# Altium schematic sheet PICZone.SchDoc: PIC
size A4; Organization: Autobot Limited; Address1: 96, boulevard Bessiere; Address4: 75017 PARIS; SheetNumber: 3
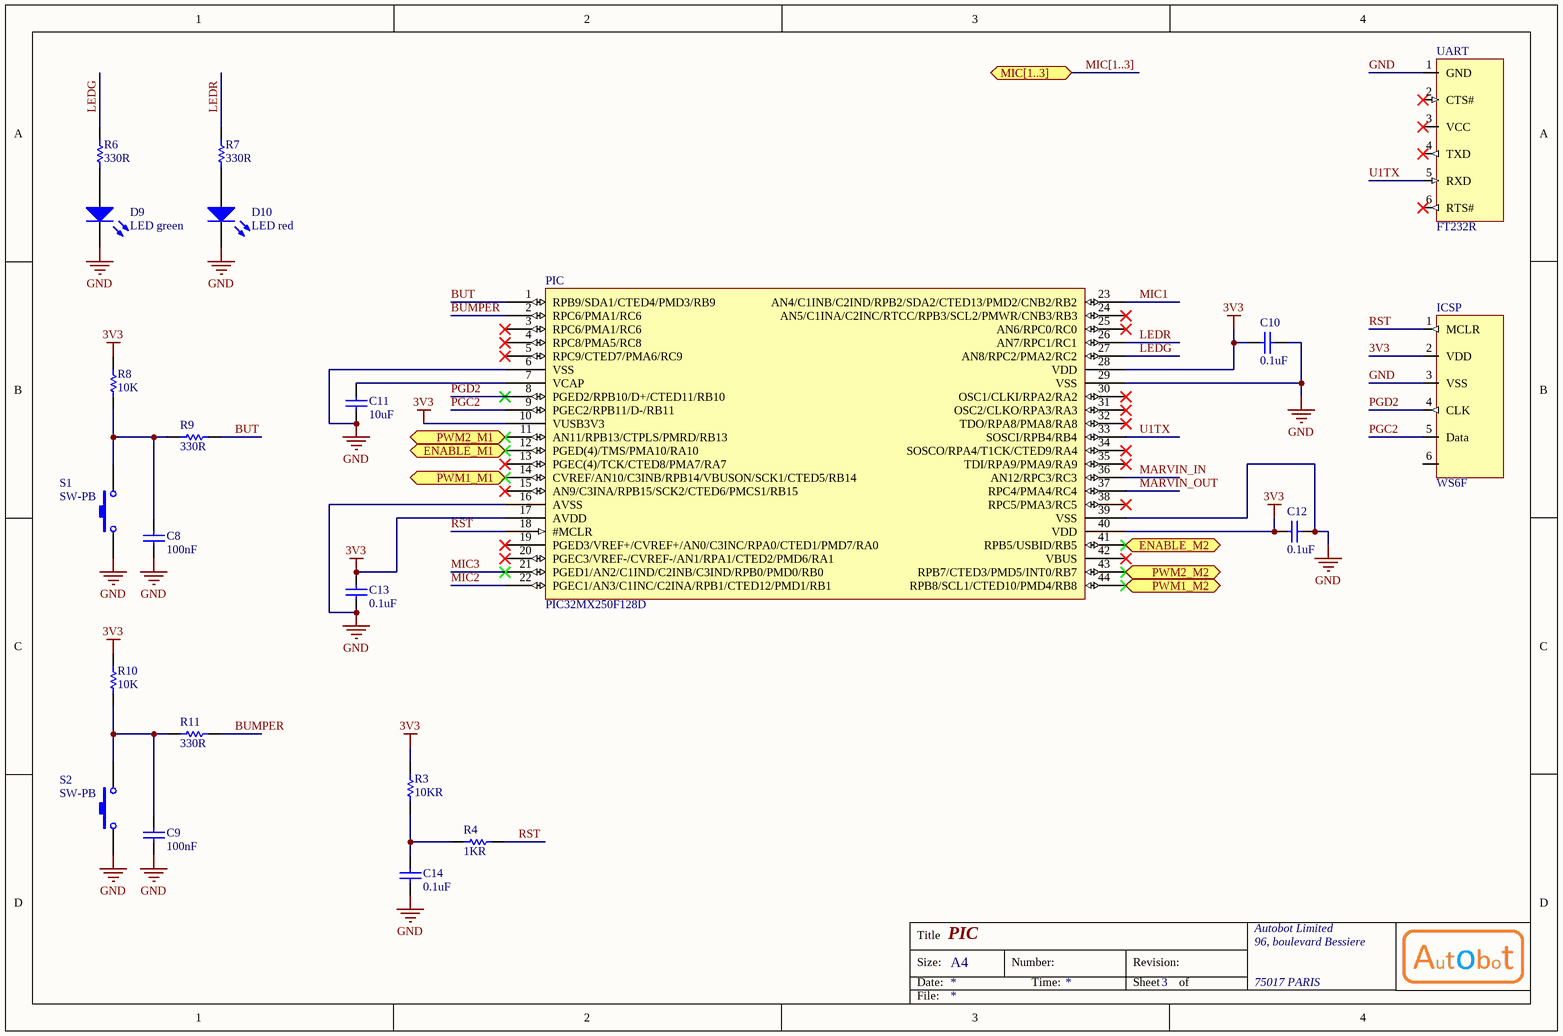
[diagram p0: PICZone.SchDoc]

## Parts
C8  100nF  [CAPC1608N]
C9  100nF  [CAPC1608N]
C10  0.1uF  [CAPC1608N]
C11  10uF  [CAPC1608N]
C12  0.1uF  [CAPC1608N]
C13  0.1uF  [CAPC1608N]
C14  0.1uF  [CAPC1608N]
D9  LED green  [LED1608]
D10  LED red  [LED1608]
ICSP  WS6F  [6-pin Connector]
PIC  PIC32MX250F128D  [44TQFP]
R3  10KR  [RESC1608N]
R4  1KR  [RESC1608N]
R6  330R  [RESC1608N]
R7  330R  [RESC1608N]
R8  10K  [RESC1608N]
R9  330R  [RESC1608N]
R10  10K  [RESC1608N]
R11  330R  [RESC1608N]
S1  SW-PB  [SPST-2]
S2  SW-PB  [SPST-2]
UART  FT232R  [6-pin Connector]

## Ports
ENABLE_M1 (out), ENABLE_M2 (out), MIC[1..3], PWM1_M1 (out), PWM1_M2 (out), PWM2_M1 (out), PWM2_M2 (out)

## Nets
3V3: C10.2 C12.2 C13.1 ICSP.2(VDD) PIC.10(VUSB3V3) PIC.17(AVDD) PIC.28(VDD) PIC.40(VDD) R3.1 R8.2 R10.2
GND: C8.2 C9.2 C10.1 C11.2 C12.1 C13.2 C14.1 D9.2(K) D10.2(K) ICSP.3(VSS) PIC.6(VSS) PIC.16(AVSS) PIC.29(VSS) PIC.39(VSS) S1.1 S2.1 UART.1(GND)
BUMPER: PIC.2(RPC6/PMA1/RC6) R11.1
BUT: PIC.1(RPB9/SDA1/CTED4/PMD3/RB9) R9.1
ENABLE_M1: PIC.12(PGED(4)/TMS/PMA10/RA10) ; port ENABLE_M1
ENABLE_M2: PIC.41(RPB5/USBID/RB5) ; port ENABLE_M2
LEDG: PIC.27(AN8/RPC2/PMA2/RC2) R6.2
LEDR: PIC.26(AN7/RPC1/RC1) R7.2
MARVIN_IN: PIC.36(AN12/RPC3/RC3)
MARVIN_OUT: PIC.37(RPC4/PMA4/RC4)
MIC1: PIC.23(AN4/C1INB/C2IND/RPB2/SDA2/CTED13/PMD2/CNB2/RB2)
MIC2: PIC.22(PGEC1/AN3/C1INC/C2INA/RPB1/CTED12/PMD1/RB1)
MIC3: PIC.21(PGED1/AN2/C1IND/C2INB/C3IND/RPB0/PMD0/RB0)
PGC2: ICSP.5(Data) PIC.9(PGEC2/RPB11/D-/RB11)
PGD2: ICSP.4(CLK) PIC.8(PGED2/RPB10/D+/CTED11/RB10)
PWM1_M1: PIC.14(CVREF/AN10/C3INB/RPB14/VBUSON/SCK1/CTED5/RB14) ; port PWM1_M1
PWM1_M2: PIC.44(RPB8/SCL1/CTED10/PMD4/RB8) ; port PWM1_M2
PWM2_M1: PIC.11(AN11/RPB13/CTPLS/PMRD/RB13) ; port PWM2_M1
PWM2_M2: PIC.43(RPB7/CTED3/PMD5/INT0/RB7) ; port PWM2_M2
RST: ICSP.1(MCLR) PIC.18(#MCLR) R4.1
U1TX: PIC.33(SOSCI/RPB4/RB4) UART.5(RXD)
NetC8_1: C8.1 R8.1 R9.2 S1.2
NetC9_1: C9.1 R10.1 R11.2 S2.2
NetC11_1: C11.1 PIC.7(VCAP)
NetC14_2: C14.2 R3.2 R4.2
NetD9_1: D9.1(A) R6.1
NetD10_1: D10.1(A) R7.1

Not connected (* = marked no-connect by the designer): ICSP 6; PIC 3(RPC6/PMA1/RC6)* 4(RPC8/PMA5/RC8)* 5(RPC9/CTED7/PMA6/RC9)* 13(PGEC(4)/TCK/CTED8/PMA7/RA7)* 15(AN9/C3INA/RPB15/SCK2/CTED6/PMCS1/RB15)* 19(PGED3/VREF+/CVREF+/AN0/C3INC/RPA0/CTED1/PMD7/RA0)* 20(PGEC3/VREF-/CVREF-/AN1/RPA1/CTED2/PMD6/RA1)* 24(AN5/C1INA/C2INC/RTCC/RPB3/SCL2/PMWR/CNB3/RB3)* 25(AN6/RPC0/RC0)* 30(OSC1/CLKI/RPA2/RA2)* 31(OSC2/CLKO/RPA3/RA3)* 32(TDO/RPA8/PMA8/RA8)* 34(SOSCO/RPA4/T1CK/CTED9/RA4)* 35(TDI/RPA9/PMA9/RA9)* 38(RPC5/PMA3/RC5)* 42(VBUS)*; UART 2(CTS#)* 3(VCC)* 4(TXD)* 6(RTS#)*

## Buses and harness runs
bus MIC[1..3] = port MIC[1..3]

## Notes on the sheet
- Title
- Size:
- Date:
- A4
- Number:
- Time:
- Revision:
- Sheet
- of
- File:

## Library data of the parts
C8-C14 = Cap: Capacitor; Published: 8-Jun-2000; LatestRevisionDate: 17-Jul-2002; LatestRevisionNote: Re-released for DXP Platform.; PackageReference: RAD-0.3; Publisher: Altium Limited; PackageDescription: Radial Cap, Thru-Hole; 2 Leads; 0.3 in Pin Spacing
  C8 C9: Value: 100nF
  C10 C12-C14: Value: 0.1uF
  C11: Value: 10uF
D9 D10 = LED0: Typical INFRARED GaAs LED; Fabricant: DIODES INC.; Fournisseur: Farnell; RefFabricant: MURS140-13-F; RefFournisseur: 1858656; Published: 8-Jun-2000; LatestRevisionDate: 08-Jul-2005; LatestRevisionNote: Mech Layer 1 removed.; PackageReference: LED-0; Publisher: Altium Limited; PackageDescription: LED; 2 Leads
ICSP = WS6F: Fabricant: MOLEX; Fournisseur: Farnell; RefFournisseur: 1462951; RefFabricant: 22-11-2062
PIC = PIC32MX250F128D: Fabricant: MICROCHIP; Fournisseur: Farnell; RefFabricant: PIC32MX250F128D-50I-PT; RefFournisseur: 2357347
R3 R4 R6-R11 = Res1: Resistor; Published: 8-Jun-2000; LatestRevisionDate: 17-Jul-2002; LatestRevisionNote: Re-released for DXP Platform.; PackageReference: AXIAL-0.3; Publisher: Altium Limited; PackageDescription: Axial Device, Thru-Hole; 2 Leads; 0.3 in Pin Spacing
  R3: Value: 10KR
  R4: Value: 1KR
  R6 R7 R9 R11: Value: 330R
  R8 R10: Value: 10K
S1 = SW-PB: Switch; Fabricant: MULTICOMP; Fournisseur: Farnell; RefFabricant: R13-509B-05-BB; RefFournisseur: 1634683; Published: 24-Mar-1999; LatestRevisionDate: 17-Jul-2002; LatestRevisionNote: Re-released for DXP Platform.; PackageReference: SPST-2; Publisher: Altium Limited; PackageDescription: Switch; 2 Leads
S2 = SW-PB: Switch; Fabricant: MULTICOMP; Fournisseur: Farnell; RefFabricant: R13-509B-05-BR; RefFournisseur: 1634685; Published: 24-Mar-1999; LatestRevisionDate: 17-Jul-2002; LatestRevisionNote: Re-released for DXP Platform.; PackageReference: SPST-2; Publisher: Altium Limited; PackageDescription: Switch; 2 Leads
UART = FT232R: Fabricant: MOLEX; Fournisseur: Farnell; RefFournisseur: 9731164; RefFabricant: 22-27-2041